# EAGLE design 2x8 GPIO board (EAGLE 6.2)
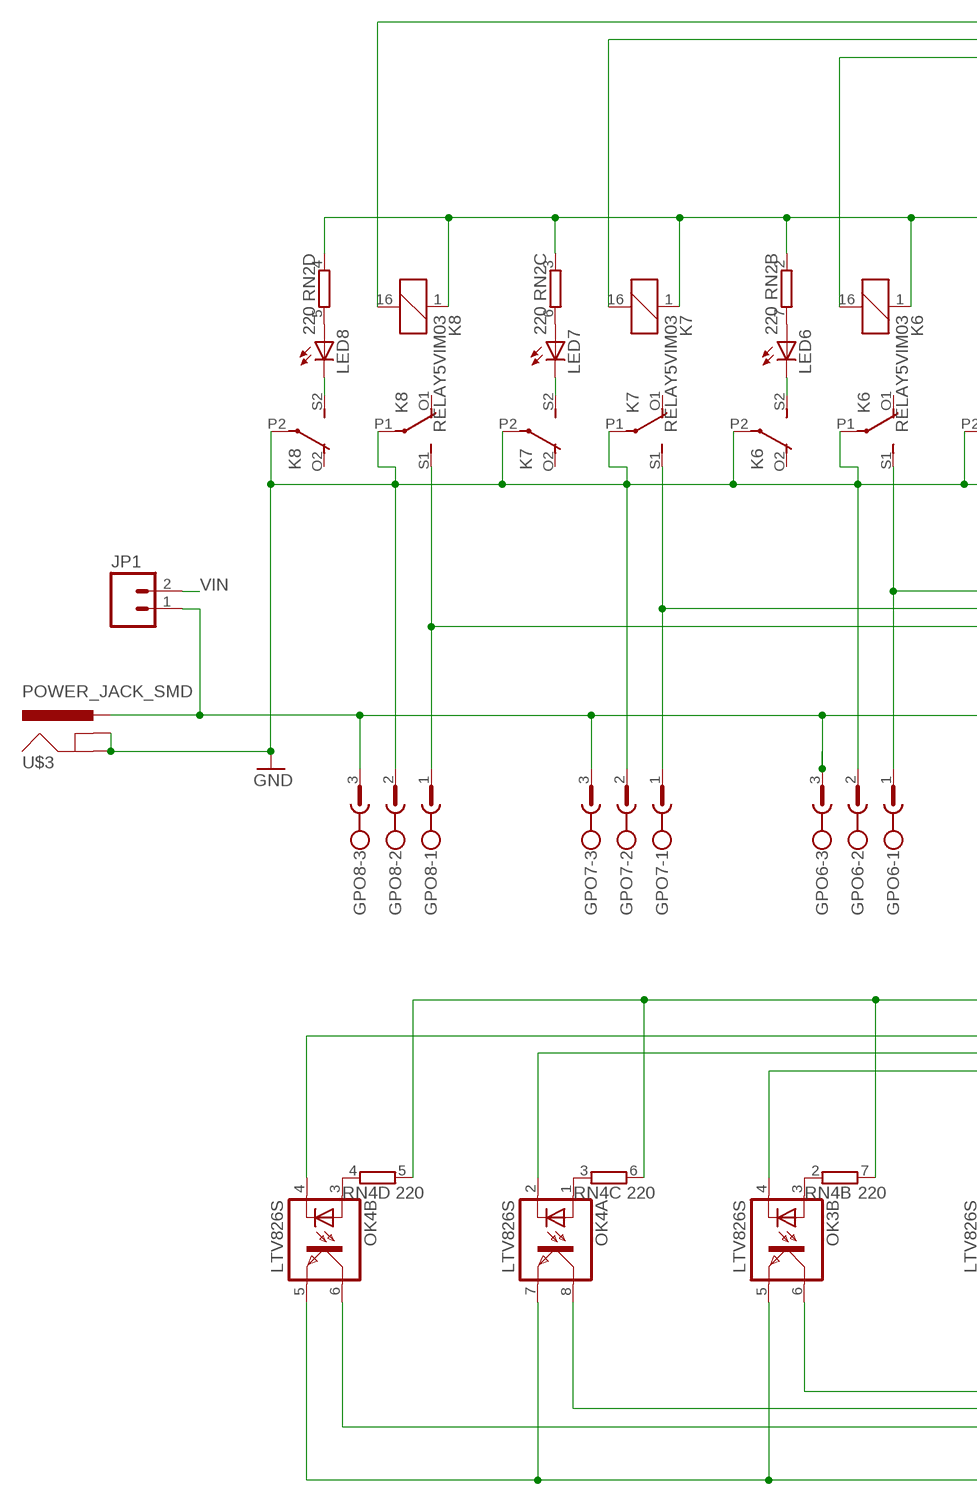
[diagram p0: schematic, sheet 1, part 1 of 2]
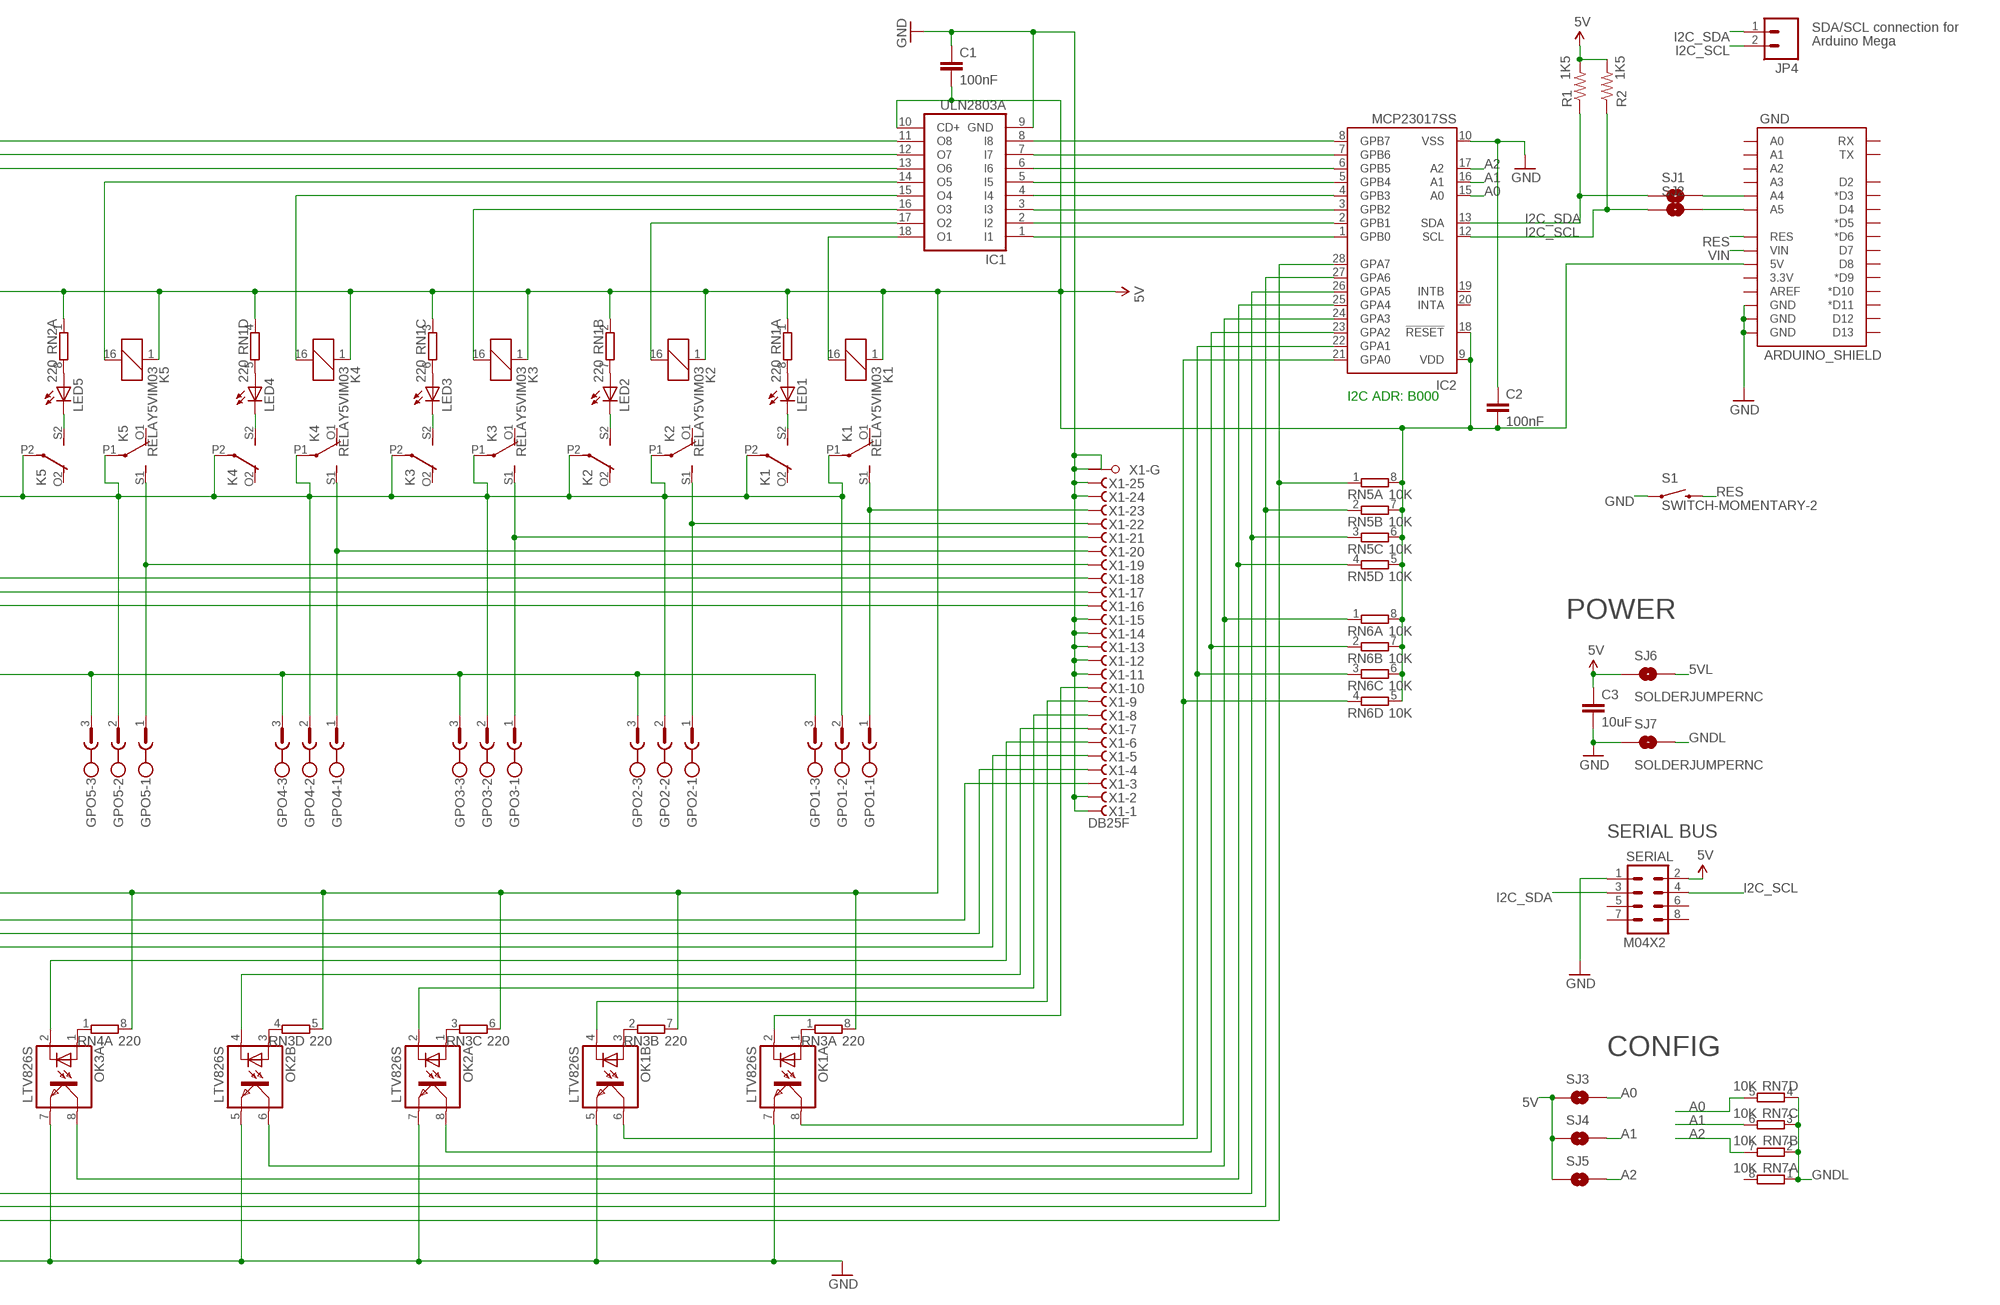
[diagram p1: schematic, sheet 1, part 2 of 2]

## Parts
C1  100nF  CAP0805  [0805]
C2  100nF  CAP0603-CAP  [0603-CAP]
C3  10uF  CAP0805  [0805]
GND  ARDUINO_SHIELD  [ARDUINO_BOXSHIELD_NOHOLES]
GPO1  CON1  MSTBV3  [MSTBV3]
GPO2  CON1  MSTBV3  [MSTBV3]
GPO3  CON1  MSTBV3  [MSTBV3]
GPO4  CON1  MSTBV3  [MSTBV3]
GPO5  CON1  MSTBV3  [MSTBV3]
GPO6  CON1  MSTBV3  [MSTBV3]
GPO7  CON1  MSTBV3  [MSTBV3]
GPO8  GPO8  MSTBV3  [MSTBV3]
IC1  ULN2803A  ULN2803ASO18W  [SO18W]
IC2  MCP23017SS  [SSOP28]
JP1  M02LOCK  [1X02_LOCK]
JP4  M02PTH  [1X02]
K1  RELAY5VIM03  [DS2Y]
K2  RELAY5VIM03  [DS2Y]
K3  RELAY5VIM03  [DS2Y]
K4  RELAY5VIM03  [DS2Y]
K5  RELAY5VIM03  [DS2Y]
K6  RELAY5VIM03  [DS2Y]
K7  RELAY5VIM03  [DS2Y]
K8  RELAY5VIM03  [DS2Y]
LED1  LED0603  [LED-0603]
LED2  LED0603  [LED-0603]
LED3  LED0603  [LED-0603]
LED4  LED0603  [LED-0603]
LED5  LED0603  [LED-0603]
LED6  LED0603  [LED-0603]
LED7  LED0603  [LED-0603]
LED8  LED0603  [LED-0603]
OK1  LTV826S  [DIL8-SMD]
OK2  LTV826S  [DIL8-SMD]
OK3  LTV826S  [DIL8-SMD]
OK4  LTV826S  [DIL8-SMD]
R1  1K5  RESISTOR0603-RES  [0603-RES]
R2  1K5  RESISTOR0603-RES  [0603-RES]
RN1  220  4R-NCAY16  [CAY16]
RN2  220  4R-NCAY16  [CAY16]
RN3  220  4R-NCAY16  [CAY16]
RN4  220  4R-NCAY16  [CAY16]
RN5  10K  4R-NCAY16  [CAY16]
RN6  10K  4R-NCAY16  [CAY16]
RN7  10K  4R-NCAY16  [CAY16_HAND]
S1  SWITCH-MOMENTARY-2  [TACTILE_SWITCH_TALL]
SERIAL  M04X2  [2X4]
SJ1  SOLDERJUMPERNC  [SJ_2S]
SJ2  SOLDERJUMPERNC  [SJ_2S]
SJ3  SOLDERJUMPERNC  [SJ_2S]
SJ4  SOLDERJUMPERNC  [SJ_2S]
SJ5  SOLDERJUMPERNC  [SJ_2S]
SJ6  SOLDERJUMPERNC  [SJ_2S]
SJ7  SOLDERJUMPERNC  [SJ_2S]
U$3  POWER_JACK_SMD  [POWER_JACK_SMD]
X1  DB25F  F25HPS  [F25HP]

## Nets
5V [PWR]: C1.2 C2.2 C3.1 GND.5V@0(5V) IC1.10(CD+) IC2.9(VDD) IC2.18(!RESET) K1.1 K2.1 K3.1 K4.1 K5.1 K6.1 K7.1 K8.1 R1.2 R2.2 RN1.1 RN1.2 RN1.3 RN1.4 RN2.1 RN2.2 RN2.3 RN2.4 RN3.5 RN3.6 RN3.7 RN3.8 RN4.5 RN4.6 RN4.7 RN4.8 RN5.5 RN5.6 RN5.7 RN5.8 RN6.5 RN6.6 RN6.7 RN6.8 SERIAL.2 SJ3.1 SJ4.1 SJ5.1 SJ6.1
5VL: SJ6.2
A0: IC2.15(A0) RN7.5 SJ3.2
A1: IC2.16(A1) RN7.6 SJ4.2
A2: IC2.17(A2) RN7.7 SJ5.2
GND [PWR]: C1.1 C2.1 C3.2 GND.GND@0(GND) GND.GND@1(GND) GND.GND@4(GND) GPO1.2 GPO2.2 GPO3.2 GPO4.2 GPO5.2 GPO6.2 GPO7.2 GPO8.2 IC1.9(GND) IC2.10(VSS) K1.P1(2:P) K1.P2(3:P) K2.P1(2:P) K2.P2(3:P) K3.P1(2:P) K3.P2(3:P) K4.P1(2:P) K4.P2(3:P) K5.P1(2:P) K5.P2(3:P) K6.P1(2:P) K6.P2(3:P) K7.P1(2:P) K7.P2(3:P) K8.P1(2:P) K8.P2(3:P) OK1.5(B:EMIT) OK1.7(A:EMIT) OK2.5(B:EMIT) OK2.7(A:EMIT) OK3.5(B:EMIT) OK3.7(A:EMIT) OK4.5(B:EMIT) OK4.7(A:EMIT) S1.A2 SERIAL.1 SJ7.1 U$3.GND U$3.SHUNT(GNDBREAK) X1.1(-1:F) X1.2(-2:F) X1.11(-11:F) X1.12(-12:F) X1.13(-13:F) X1.14(-14:F) X1.15(-15:F) X1.24(-24:F) X1.25(-25:F) X1.G1(-G:G1) X1.G2(-G:G2)
GNDL: RN7.1 RN7.2 RN7.3 RN7.4 SJ7.2
I2C_SCL: IC2.12(SCL) JP4.2 R2.1 SERIAL.4 SJ2.1
I2C_SDA: IC2.13(SDA) JP4.1 R1.1 SERIAL.3 SJ1.1
N$1 [RELAY LINES]: GPO1.1 K1.S1(2:S) X1.23(-23:F)
N$3: K1.S2(3:S) LED1.C
N$4: IC1.18(O1) K1.16
N$5: IC1.1(I1) IC2.1(GPB0)
N$6 [RELAY LINES]: GPO2.1 K2.S1(2:S) X1.22(-22:F)
N$8: K2.S2(3:S) LED2.C
N$9: IC1.17(O2) K2.16
N$10 [RELAY LINES]: GPO3.1 K3.S1(2:S) X1.21(-21:F)
N$12: K3.S2(3:S) LED3.C
N$13: IC1.16(O3) K3.16
N$14 [RELAY LINES]: GPO4.1 K4.S1(2:S) X1.20(-20:F)
N$16: K4.S2(3:S) LED4.C
N$17: IC1.15(O4) K4.16
N$18 [RELAY LINES]: GPO5.1 K5.S1(2:S) X1.19(-19:F)
N$19: GND.A4 SJ1.2
N$20: K5.S2(3:S) LED5.C
N$21: IC1.14(O5) K5.16
N$22 [RELAY LINES]: GPO6.1 K6.S1(2:S) X1.18(-18:F)
N$23: GND.A5 SJ2.2
N$24: K6.S2(3:S) LED6.C
N$25: IC1.13(O6) K6.16
N$26 [RELAY LINES]: GPO7.1 K7.S1(2:S) X1.17(-17:F)
N$28: K7.S2(3:S) LED7.C
N$29: IC1.12(O7) K7.16
N$30 [RELAY LINES]: GPO8.1 K8.S1(2:S) X1.16(-16:F)
N$31: GPO1.3 GPO2.3 GPO3.3 GPO4.3 GPO5.3 GPO6.3 GPO7.3 GPO8.3 JP1.1 U$3.PWR
N$32: K8.S2(3:S) LED8.C
N$33: IC1.11(O8) K8.16
N$34: IC1.2(I2) IC2.2(GPB1)
N$35: IC1.3(I3) IC2.3(GPB2)
N$36: IC1.4(I4) IC2.4(GPB3)
N$37: IC1.5(I5) IC2.5(GPB4)
N$38: IC1.6(I6) IC2.6(GPB5)
N$39: IC1.7(I7) IC2.7(GPB6)
N$40: IC1.8(I8) IC2.8(GPB7)
N$41: LED1.A RN1.8
N$42: LED2.A RN1.7
N$43: LED3.A RN1.6
N$44: LED4.A RN1.5
N$45: LED5.A RN2.8
N$46: LED6.A RN2.7
N$47: LED7.A RN2.6
N$48: LED8.A RN2.5
N$49 [INput lines]: OK1.2(A:C) X1.10(-10:F)
N$50: OK1.1(A:A) RN3.1
N$51: IC2.21(GPA0) OK1.8(A:COL) RN6.4
N$52: OK1.3(B:A) RN3.2
N$53: OK2.1(A:A) RN3.3
N$54: OK2.3(B:A) RN3.4
N$55 [INput lines]: OK3.2(A:C) X1.6(-6:F)
N$56: OK3.1(A:A) RN4.1
N$57: OK3.3(B:A) RN4.2
N$58: OK4.1(A:A) RN4.3
N$59: OK4.3(B:A) RN4.4
N$60 [INput lines]: OK1.4(B:C) X1.9(-9:F)
N$61 [INput lines]: OK2.2(A:C) X1.8(-8:F)
N$62 [INput lines]: OK2.4(B:C) X1.7(-7:F)
N$63: IC2.28(GPA7) OK4.6(B:COL) RN5.1
N$64 [INput lines]: OK3.4(B:C) X1.5(-5:F)
N$65 [INput lines]: OK4.2(A:C) X1.4(-4:F)
N$66 [INput lines]: OK4.4(B:C) X1.3(-3:F)
N$68: IC2.22(GPA1) OK1.6(B:COL) RN6.3
N$69: IC2.23(GPA2) OK2.8(A:COL) RN6.2
N$70: IC2.24(GPA3) OK2.6(B:COL) RN6.1
N$71: IC2.25(GPA4) OK3.8(A:COL) RN5.4
N$72: IC2.26(GPA5) OK3.6(B:COL) RN5.3
N$73: IC2.27(GPA6) OK4.8(A:COL) RN5.2
RES: GND.RESET(RES) S1.B2
VIN: GND.VIN JP1.2
Unconnected: GND.0(RX) GND.1(TX) GND.2(D2) GND.3(*D3) GND.3.3V GND.4(D4) GND.5(*D5) GND.6(*D6) GND.7(D7) GND.8(D8) GND.9(*D9) GND.10(*D10) GND.11(*D11) GND.12(D12) GND.13(D13) GND.A0 GND.A1 GND.A2 GND.A3 GND.AREF IC2.19(INTB) IC2.20(INTA) K1.O1(2:O) K1.O2(3:O) K2.O1(2:O) K2.O2(3:O) K3.O1(2:O) K3.O2(3:O) K4.O1(2:O) K4.O2(3:O) K5.O1(2:O) K5.O2(3:O) K6.O1(2:O) K6.O2(3:O) K7.O1(2:O) K7.O2(3:O) K8.O1(2:O) K8.O2(3:O) RN7.8 SERIAL.5 SERIAL.6 SERIAL.7 SERIAL.8

## Notes on the sheet
- SDA/SCL connection for
- Arduino Mega
- I2C ADR: B000
- POWER
- SERIAL BUS
- CONFIG

## Library data of the parts
C1-C3 = SparkFun:CAP: Capacitor Standard 0603 ceramic capacitor, and 0.1" leaded capacitor.
GND = SKAARHOJ:ARDUINO_SHIELD
GPO1-GPO8 = con-phoenix-508:MSTBV3: PHOENIX; MPN: MSTBV 2,5/3-GF-5.08; OC_FARNELL: 1792793; OC_NEWARK: 69R9846
IC1 = uln-udn:ULN2803A: DRIVER ARRAY
IC2 = microchip:MCP23017: http://ww1.microchip.com/downloads/en/DeviceDoc/21952a.pdf Source: http://ww1.microchip.com/downloads/en/DeviceDoc/21952a.pdf; MF: MICROCHIP; MPN: MCP23017-E/SS; OC_FARNELL: 1467674; OC_NEWARK: 31K2960
JP1 JP4 = SparkFun:M02: Header 2 Standard 2-pin 0.1" header. Use with straight break away headers (SKU : PRT-00116), right angle break away headers (PRT-00553), swiss pins (PRT-00743), machine pins (PRT-00117), and female headers (PRT-00115). Molex polarized connector foot print use with SKU : PRT-08233 with associated crimp pins and housings.
K1-K8 = SKAARHOJ:RELAY5V: RELAY 2 x switch, AxiCom 150 mW 5V
LED1-LED8 = SparkFun:LED: LEDs Standard schematic elements and footprints for 5mm, 3mm, 1206, and 0603 sized LEDs. 5mm - Spark Fun Electronics SKU : COM-00529 (and others)
OK1-OK4 = optocoupler:LTV826: OPTO COUPLER Source: LITEON, LTV816.pdf; OC_FARNELL: unknown; OC_NEWARK: unknown
R1 R2 = SparkFun:RESISTOR: Resistor Basic schematic elements and footprints for 0603, 1206, and PTH resistors.
RN1-RN6 = resistor-dil:4R-N: Array Chip Resistor Source: RS Component / Phycomp; OC_FARNELL: unknown; OC_NEWARK: unknown
RN7 = SKAARHOJ:4R-N: Array Chip Resistor Source: RS Component / Phycomp; OC_FARNELL: unknown; OC_NEWARK: unknown
S1 = SparkFun:SWITCH-MOMENTARY-2
SERIAL = SparkFun:M04X2
SJ1-SJ7 = SparkFun:SOLDERJUMPER: Solder Jumper Standard SMD solder jumper. Used to automate production. Two varients : Normally Open and Normally Closed are the same, but have different paste layers. NC will have a large amount of paste and should jumper during reflow.
U$3 = SKAARHOJ:POWER_JACK_SMD: RASM712PX Right Angle SMT Mount DC Power Jack, pin size 0.100"(2.5mm), with locating post Switchcraft.com
X1 = con-subd:F25HPS: SUB-D; OC_FARNELL: unknown; OC_NEWARK: unknown

## Net classes
0 default: width 0.203 mm, drill 0.406 mm, clearance 0.203 mm
1 PWR: width 0.406 mm, drill 0.61 mm, clearance 0.203 mm
2 RELAY LINES: width 0.305 mm, clearance 0.203 mm
3 INput lines: clearance 0.203 mm

## Board
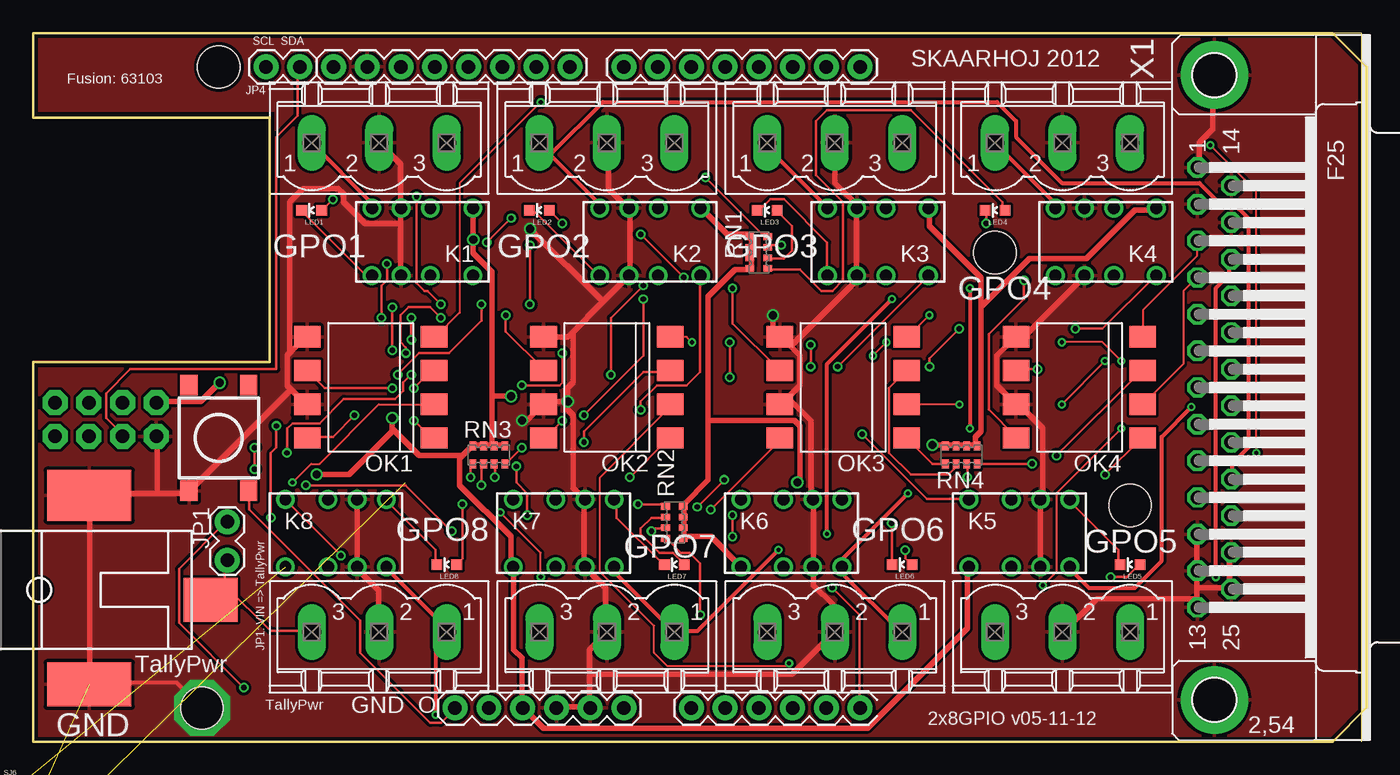
[diagram p2: board, top side]
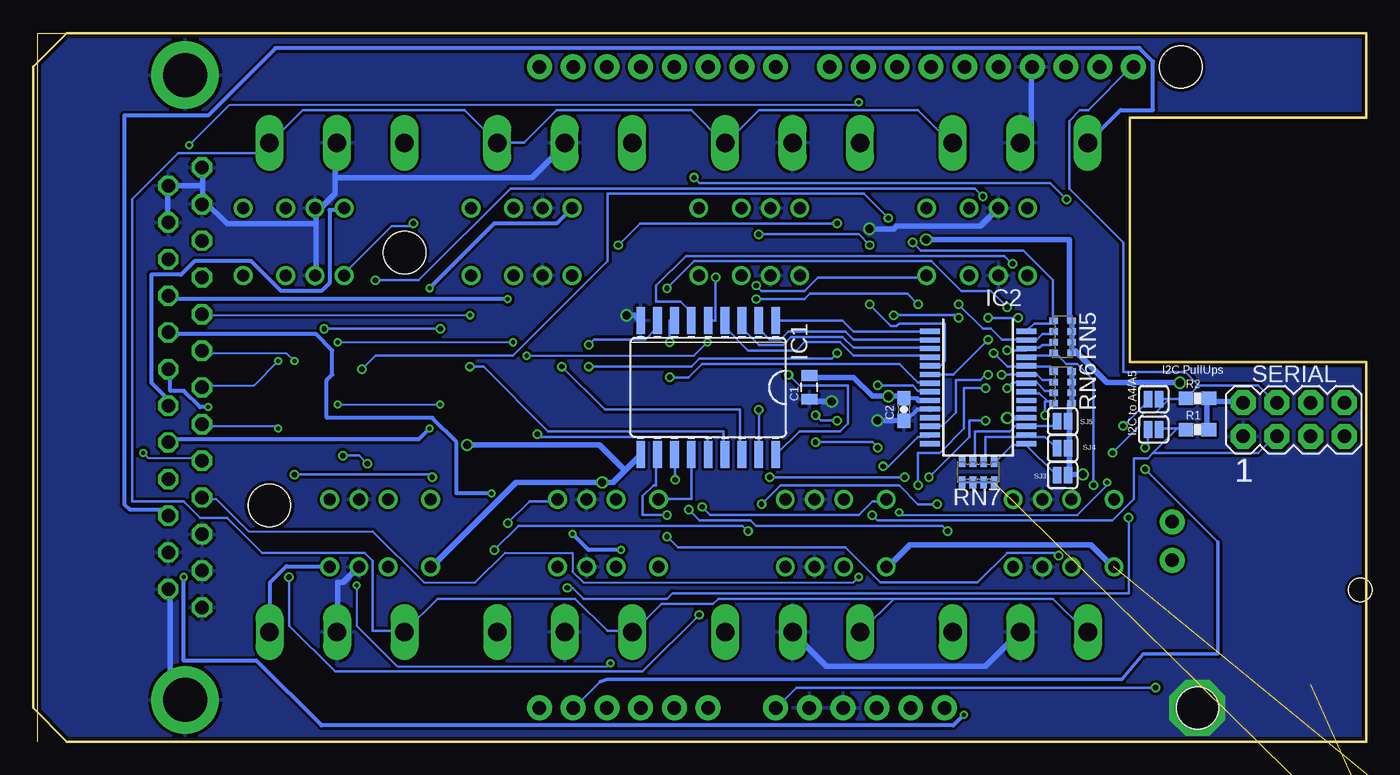
[diagram p3: board, bottom side, seen from below]

Size 100.33 x 53.34 mm. Coordinates in mm from the lower left corner, seen from the top.
Outline: 100,0 100,53.33 0,53.33
Copper layers (1*16): Top 0.035mm / dielectric 1.5mm / Bottom 0.035mm
Design rules: minimum track width 6mil, minimum drill 12mil, track to track 6mil, track to pad 6mil, pad to pad 6mil, via to via 6mil, smd to smd 0mil, copper to edge 10mil, drill to drill 10mil, minimum pad ring 10mil, minimum via ring 6mil, stop-mask expansion 2mil, vias tented up to drill 100mil, thermal gap 10mil
Holes 3.2 mm at 72.39,36.83 82.55,17.78

### Footprints (pad centres in the part's own frame; a part is rotated, then mirrored left to right if it is on the bottom)
0805 = smd 0.8 x 1.2: 1 -0.9,0; 2 0.9,0
0603-CAP = smd 1.1 x 1: 1 -0.85,0; 2 0.85,0
ARDUINO_BOXSHIELD_NOHOLES = drill 1.016 pad 1.88: 0 62.23,50.8; 1 59.69,50.8; 2 57.15,50.8; 3 54.61,50.8; 3.3V 34.29,2.54; 4 52.07,50.8; 5 49.53,50.8; 5V@0 36.83,2.54; 6 46.99,50.8; 7 44.45,50.8; 8 40.386,50.8; 9 37.846,50.8; 10 35.306,50.8; 11 32.766,50.8; 12 30.226,50.8; 13 27.686,50.8; A0 49.53,2.54; A1 52.07,2.54; A2 54.61,2.54; A3 57.15,2.54; A4 59.69,2.54; A5 62.23,2.54; AREF 22.606,50.8; GND@0 39.37,2.54; GND@1 41.91,2.54; GND@4 25.146,50.8; RESET 31.75,2.54; VIN 44.45,2.54 | hole 3.2: 13.97,50.8; 12.7,2.54
MSTBV3 = drill 1.397 long: 1 -5.08,0; 2 0,0; 3 5.08,0
SO18W = smd 0.66 x 2.032: 1 -5.08,-5.029; 2 -3.81,-5.029; 3 -2.54,-5.029; 4 -1.27,-5.029; 5 0,-5.029; 6 1.27,-5.029; 7 2.54,-5.029; 8 3.81,-5.029; 9 5.08,-5.029; 10 5.08,5.029; 11 3.81,5.029; 12 2.54,5.029; 13 1.27,5.029; 14 0,5.029; 15 -1.27,5.029; 16 -2.54,5.029; 17 -3.81,5.029; 18 -5.08,5.029
SSOP28 = smd 0.4 x 1.5: 1 -4.225,-3.625; 2 -3.575,-3.625; 3 -2.925,-3.625; 4 -2.275,-3.625; 5 -1.625,-3.625; 6 -0.975,-3.625; 7 -0.325,-3.625; 8 0.325,-3.625; 9 0.975,-3.625; 10 1.625,-3.625; 11 2.275,-3.625; 12 2.925,-3.625; 13 3.575,-3.625; 14 4.225,-3.625; 15 4.225,3.625; 16 3.575,3.625; 17 2.925,3.625; 18 2.275,3.625; 19 1.625,3.625; 20 0.975,3.625; 21 0.325,3.625; 22 -0.325,3.625; 23 -0.975,3.625; 24 -1.625,3.625; 25 -2.275,3.625; 26 -2.925,3.625; 27 -3.575,3.625; 28 -4.225,3.625
1X02_LOCK = drill 1.016 pad 1.88: 1 -0.178,0; 2 2.718,0
1X02 = drill 1.016 pad 1.88: 1 0,0; 2 2.54,0
DS2Y = drill 0.9: 1 1.2,0.46; 16 1.2,5.54; O1 4.4,0.46; O2 4.4,5.54; P1 6.6,0.46; P2 6.6,5.54; S1 8.8,0.46; S2 8.8,5.54
LED-0603 = smd 0.8 x 0.8: A 0,-0.75; C 0,0.75
DIL8-SMD = smd 1.6 x 2: 1 -3.81,-4.77; 2 -1.27,-4.77; 3 1.27,-4.77; 4 3.81,-4.77; 5 3.81,4.77; 6 1.27,4.77; 7 -1.27,4.77; 8 -3.81,4.77
0603-RES = smd 1.1 x 1: 1 -0.85,0; 2 0.85,0
CAY16 = smd 0.5 x 0.65: 1 -1.2,-0.675; 2 -0.4,-0.675; 3 0.4,-0.675; 4 1.2,-0.675; 5 1.2,0.675; 6 0.4,0.675; 7 -0.4,0.675; 8 -1.2,0.675
CAY16_HAND = smd 0.5 x 0.904: 1 -1.2,-0.813; 2 -0.4,-0.813; 3 0.4,-0.813; 4 1.2,-0.813; 5 1.2,0.813; 6 0.4,0.813; 7 -0.4,0.813; 8 -1.2,0.813
TACTILE_SWITCH_TALL = smd 1.55 x 1.3: A1 -3.975,-2.25; A2 3.975,-2.25; B1 -3.975,2.25; B2 3.975,2.25
2X4 = drill 1.016 pad 1.88 octagon: 1 -3.81,-1.27; 2 -3.81,1.27; 3 -1.27,-1.27; 4 -1.27,1.27; 5 1.27,-1.27; 6 1.27,1.27; 7 3.81,-1.27; 8 3.81,1.27
SJ_2S = smd 0.635 x 1.27: 1 -0.412,0; 2 0.412,0
POWER_JACK_SMD = smd 6.35 x 3.81: GND -6.756,-7.112 | smd 4.064 x 3.302: PWR -15.9,0.762 | smd 6.35 x 3.302: SHUNT -6.756,7.112 | hole 1.778: -2.997,0
F25HP = drill 1.016 octagon: 1 -16.561,-1.27; 2 -13.792,-1.27; 3 -11.049,-1.27; 4 -8.28,-1.27; 5 -5.512,-1.27; 6 -2.769,-1.27; 7 0,-1.27; 8 2.769,-1.27; 9 5.512,-1.27; 10 8.28,-1.27; 11 11.049,-1.27; 12 13.792,-1.27; 13 16.561,-1.27; 14 -15.189,1.27; 15 -12.421,1.27; 16 -9.652,1.27; 17 -6.909,1.27; 18 -4.14,1.27; 19 -1.372,1.27; 20 1.372,1.27; 21 4.14,1.27; 22 6.909,1.27; 23 9.652,1.27; 24 12.421,1.27; 25 15.189,1.27 | drill 3.302 pad 5.08: G1 -23.52,0; G2 23.52,0

### Placement (x,y rotation side)
C1  41.91,26.67 90 bottom
C2  34.8,25.02 90 bottom
C3  -1.27,-12.7 0 top  (outside the outline)
GND  0,0 0 top
GPO1  26.04,45.09 0 top
GPO2  43.18,45.09 0 top
GPO3  60.33,45.09 0 top
GPO4  77.47,45.09 0 top
GPO5  77.47,8.26 180 top
GPO6  60.33,8.26 180 top
GPO7  43.18,8.26 180 top
GPO8  26.04,8.26 180 top
IC1  49.53,26.67 180 bottom
IC2  29.21,26.67 270 bottom
JP1  14.61,13.84 90 top
JP4  20.07,50.8 180 top
K1  34.29,40.64 180 top
K2  51.44,40.64 180 top
K3  68.58,40.64 180 top
K4  85.72,40.64 180 top
K5  69.22,12.7 0 top
K6  52.07,12.7 0 top
K7  34.92,12.7 0 top
K8  17.78,12.7 0 top
LED1  20.95,40.01 90 top
LED2  38.1,40.01 90 top
LED3  55.24,40.01 90 top
LED4  72.39,40.01 90 top
LED5  82.55,13.34 90 top
LED6  65.41,13.34 90 top
LED7  48.26,13.34 90 top
LED8  31.11,13.34 90 top
OK1  25.4,26.67 90 top
OK2  43.18,26.67 90 top
OK3  60.96,26.67 90 top
OK4  78.74,26.67 90 top
R1  12.7,23.5 0 bottom
R2  12.7,25.86 0 bottom
RN1  54.61,36.83 270 top
RN2  48.26,16.51 90 top
RN3  34.29,21.59 0 top
RN4  69.85,21.59 0 top
RN5  22.86,30.48 270 bottom
RN6  22.86,26.67 270 bottom
RN7  29.21,20.32 0 bottom
S1  13.97,22.86 270 top
SERIAL  5.46,24.26 0 bottom
SJ1  16,23.5 180 bottom
SJ2  16,25.78 180 bottom
SJ3  22.86,20.07 180 bottom
SJ4  22.86,22.1 180 bottom
SJ5  22.86,24.13 180 bottom
SJ6  -1.27,-3.81 0 top  (outside the outline)
SJ7  -1.27,-8.89 0 top  (outside the outline)
U$3  -2.54,11.43 180 top
X1  88.9,26.67 270 top

### Tracks (layer width: path | path; a pad name or v marks a point on that pad's centre or on a via)
5V  (via drill 0.61)  (2 unrouted)
  Top 0.406: K2.1 50.39,40.03 52.22,38.2 53.85,38.2 RN1.1 54.05,38 54.05,37.39 RN1.2 54.05,37.19 54.05,36.58 RN1.3 54.05,36.37 54.05,35.76 RN1.4 53.85,35.56 52.83,35.56 50.8,33.53 50.8,24.18 | K6.1 53.24,13.21 51,15.44 49.17,15.44 RN2.1 48.97,15.44 48.97,16.05 RN2.2 48.97,16.26 48.97,16.87 RN2.3 48.97,17.07 48.97,17.68 RN2.4 48.97,17.88 50.8,19.71 50.8,24.18 | 71.32,32.72 71.32,34.95 67.46,38.81 67.46,40.03 K3.1 | 71.32,32.72 71.32,23.37 70.92,22.96 70.92,22.55 RN4.5 70.92,22.35 70.31,22.35 RN4.6 70.1,22.35 69.49,22.35 RN4.7 69.29,22.35 68.68,22.35 RN4.8 68.48,22.35 v67.67,22.35 | 71.32,32.72 74.98,36.37 79.25,36.37 82.91,40.03 84.33,40.03 K4.1 | 50.8,24.18 57.3,24.18 57.71,23.77 57.71,19.71 v57.51,19.51 | v14.02,27.03 12.6,25.6 9.35,25.6 SERIAL.2 | RN3.6 34.75,22.35 35.36,22.35 RN3.5 | RN3.6 34.54,22.35 33.93,22.35 RN3.7 33.73,22.35 33.12,22.35 RN3.8 32.92,22.15 32.21,21.44 | 32.21,21.44 32.11,21.34 32.11,19.3 35.97,15.44 35.97,13.21 K7.1 36.17,13.01 36.17,6.91 36.78,6.3 36.78,2.64 GND.5V@0 36.98,2.44 38.41,1.02 62.79,1.02 70.31,8.53 70.31,13.01 K5.1 | v27.03,24.38 27.03,23.57 27.13,23.47 | 27.13,23.47 29.06,21.54 32.11,21.54 32.21,21.44 | 34.54,26.01 34.54,22.55 RN3.6 | 34.54,26.01 34.54,35.36 33.12,36.78 v33.12,37.8 33.12,40.03 K1.1 | 34.54,26.01 v35.97,26.01 | v21.34,20.12 23.77,20.12 27.13,23.47
  Bottom 0.305: C2.2 33.78,25.87 33.78,25.65 32.84,25.65 IC2.9
  Bottom 0.406: 55.78,20.42 56.69,19.51 v57.51,19.51 64.01,19.51 70.31,13.21 K5.1 | 55.78,20.42 54.66,21.54 IC1.10 | 55.78,20.42 57.71,22.35 v67.67,22.35 | R1.2 11.99,23.57 11.99,25.81 R2.2 11.79,25.81 11.58,25.6 9.35,25.6 SERIAL.2 | v14.02,27.03 19.51,27.03 21.95,29.46 RN5.5 22.15,29.46 22.15,30.07 RN5.6 22.15,30.28 22.15,30.68 RN5.7 22.15,31.09 22.15,31.5 RN5.8 22.35,31.7 22.35,37.8 v33.12,37.8 | RN6.8 22.15,27.84 22.15,27.23 RN6.7 22.15,27.03 22.15,26.42 RN6.6 22.15,26.21 22.15,25.6 RN6.5 22.35,25.4 22.35,24.18 SJ5.1 22.35,23.98 22.35,22.15 SJ4.1 22.35,21.95 22.35,20.12 SJ3.1 22.15,20.12 v21.34,20.12 | C1.2 41.86,27.43 38.61,27.43 37.19,26.01 v35.97,26.01 34.95,26.01 C2.2 | v27.03,24.38 25.6,24.38 IC2.18 | K8.1 19.1,13.21 20.73,14.83 34.34,14.83 35.97,13.21 K7.1
A0
  Bottom 0.203: 25.6,22.35 26.62,22.35 27.84,21.13 RN7.5 | 25.6,22.35 23.37,20.12 SJ3.2 | 25.6,22.35 IC2.15
A1
  Bottom 0.203: RN7.6 28.65,21.13 28.65,22.96 25.6,22.96 IC2.16 25.4,22.96 24.18,22.96 23.37,22.15 SJ4.2
A2
  Bottom 0.203: RN7.7 29.46,21.13 29.46,23.37 26.82,23.37 26.42,23.77 25.6,23.77 IC2.17 25.4,23.77 23.57,23.77 23.37,23.98 SJ5.2
GND  (via drill 0.61, 3.2)  (2 unrouted)
  Top 0.305: 4.27,4.47 10.77,4.47 v12.7,2.54
  Top 0.406: 27.64,39.01 27.64,40.03 K1.P1 27.64,40.23 27.64,43.48 GPO1.2 | 27.64,39.01 27.64,35.15 K1.P2 | 19.41,26.52 19.1,26.82 19.1,29.06 19.41,29.36 | 19.41,26.52 20.52,25.4 OK1.7 | 19.41,29.36 20.52,30.48 OK1.5 | 9.35,18.69 4.27,18.69 U$3.GND 4.27,18.49 4.27,4.47 U$3.SHUNT | 9.35,18.69 11.58,18.69 S1.A2 11.79,18.9 19.41,26.52 | 9.35,18.69 9.35,22.96 SERIAL.1 | 27.64,39.01 24.99,39.01 23.37,40.64 23.37,41.25 22.96,41.66 20.32,41.66 19.3,40.64 19.3,29.46 19.41,29.36 | v40.23,25.6 38.81,25.6 38.61,25.4 OK2.7 37.19,24.18 v36.78,24.18 | OK2.5 40.23,30.48 40.54,30.79 | 42.88,33.12 44.7,34.95 K2.P2 44.91,35.15 44.91,40.03 K2.P1 44.7,40.23 43.28,41.66 43.28,44.91 GPO2.2 | 42.88,33.12 40.54,30.79 | v40.23,25.6 40.23,26.62 40.64,27.03 40.64,30.68 40.54,30.79 | K8.P2 24.38,18.09 24.38,13.21 K8.P1 24.38,13.01 26.01,11.38 26.01,8.33 GPO8.2 | GND.GND@0 39.42,2.64 41.86,2.64 GND.GND@1 41.86,2.85 41.86,5.08 | 41.86,5.08 41.86,6.91 43.08,8.13 GPO7.2 43.08,8.33 43.08,11.58 41.66,13.01 K7.P1 41.45,13.21 41.45,18.09 K7.P2 41.45,18.29 40.64,19.1 40.64,24.59 40.23,24.99 v40.23,25.6 | OK3.5 56.29,30.48 57.71,29.06 57.71,26.82 56.29,25.4 OK3.7 56.9,25.81 58.52,24.18 58.52,18.29 K6.P2 58.73,18.09 58.73,13.21 K6.P1 58.73,13.01 58.73,11.79 60.15,10.36 60.15,8.33 GPO6.2 60.15,8.13 57.1,5.08 41.86,5.08 | v55.68,32.11 55.68,30.89 56.08,30.48 OK3.5 | GPO3.2 60.35,44.91 60.35,42.06 62.18,40.23 K3.P1 61.98,40.03 61.98,35.15 K3.P2 62.18,34.95 57.1,29.87 OK3.5 | 87.58,11.58 87.58,12.8 X1.12 87.58,13.01 87.58,15.44 X1.11 | 87.58,11.58 87.58,10.77 | 87.58,10.77 87.58,10.16 X1.13 87.58,10.77
  Top 0.406: 87.58,11.58 90.02,11.58 X1.25 90.02,11.79 90.02,14.22 X1.24 | K5.P1 75.79,13.21 75.79,18.09 K5.P2 76,18.29 76,23.57 74.17,25.4 OK4.7 72.54,26.82 72.54,29.06 OK4.5 74.57,30.48 79.05,34.95 K4.P2 | X1.G1 88.8,50.19 88.8,46.13 87.78,45.11 87.78,43.28 X1.1 | 87.58,10.77 80.06,10.77 77.62,8.33 GPO5.2 | 42.88,33.12 v37.39,38.61
  Bottom 0.305: C2.1 34.63,24.17 33.78,25.02 32.86,25.02 IC2.10
  Bottom 0.406: GND.GND@4 25.2,50.8 25.2,45.11 26.01,45.11 GPO1.2 | v40.23,25.6 41.86,25.6 C1.1 | v36.78,24.18 34.95,24.18 C2.1 | GPO8.2 26.21,8.13 28.65,5.69 40.64,5.69 43.08,8.13 GPO7.2 | v55.68,32.11 55.07,32.11 54.66,31.7 IC1.9 | X1.25 90.02,11.38 90.02,3.25 89,3.25 X1.G2 | GPO5.2 77.42,8.33 77.42,11.99 77.01,11.99 76,13.01 K5.P1 | X1.15 90.22,39.22 90.22,41.86 X1.14 87.58,41.86 | 87.58,41.86 87.58,43.08 X1.1 | 87.58,41.86 87.58,40.64 X1.2 87.38,40.64 85.75,39.01 79.05,39.01 | 79.05,39.01 79.05,35.15 K4.P2 | 79.05,39.01 79.05,40.03 K4.P1 78.84,40.03 77.62,41.25 77.62,42.47 | 77.62,42.47 77.62,44.91 GPO4.2 | 77.62,42.47 62.79,42.47 60.35,44.91 GPO3.2 | v37.39,38.61 35.56,38.61 35.36,38.81 29.06,38.81 27.84,40.03 K1.P1
  pour Top: 0,0 100.33,0 100.33,53.34 0,53.34
  pour Bottom: 0,0 100.33,0 100.33,53.34 0,53.34
GNDL  (1 unrouted)
  Bottom 0.203: RN7.4 RN7.3 RN7.2 RN7.1
I2C_SCL  (via drill 0.41)
  Top 0.203: v28.45,27.64 27.84,27.03 27.84,26.42 27.23,25.81 23.37,25.81 21.54,23.98 19.51,23.98 19.1,23.57 v19.1,21.74
  Bottom 0.203: 14.83,25.81 15.44,25.81 SJ2.1 | 14.83,25.81 13.61,25.81 R2.1 13.41,26.01 12.6,26.82 | v28.45,27.64 28.65,27.64 29.06,27.23 30.89,27.23 30.89,24.79 31.9,23.77 32.72,23.77 IC2.12 | v19.1,21.74 17.07,23.77 17.07,24.38 16.66,24.79 15.85,24.79 14.83,25.81 | 12.6,26.82 8.13,26.82 6.91,25.6 SERIAL.4 | 12.6,26.82 13.61,27.84 18.29,27.84 18.29,37.59 22.35,41.66 22.35,46.74 21.54,47.55 20.93,47.55 17.68,50.8 JP4.2
I2C_SDA  (via drill 0.41)
  Top 0.203: v36.37,20.73 36.37,19.51 37.19,18.69 v37.19,17.07 | JP4.1 19.91,50.8 19.91,47.14 18.29,45.52 18.29,28.04 7.32,28.04 5.49,26.21 5.49,24.38 6.71,23.16 SERIAL.3
  Bottom 0.203: 14.22,23.57 15.44,23.57 SJ1.1 | 14.22,23.57 13.61,23.57 R1.1 | v36.37,20.73 35.97,20.73 33.73,22.96 32.92,22.96 IC2.13 | v37.19,17.07 36.78,16.66 19.1,16.66 17.48,18.29 17.48,21.34 16.46,21.34 16.05,21.74 | 14.22,23.57 16.05,21.74 | 16.05,21.74 8.13,21.74 6.91,22.96 SERIAL.3
N$1
  Top 0.305: GPO1.1 25.4,40.64 25.4,40.23 K1.S1
  Bottom 0.305: X1.23 90.63,17.48 93.07,17.48 93.47,17.88 93.47,47.14 87.17,47.14 82.09,52.22 17.07,52.22 16.05,51.21 16.05,47.55 18.49,47.55 GPO1.1
N$3
  Top 0.203: LED1.C 20.32,39.83 24.99,35.15 25.4,35.15 K1.S2
N$4  (via drill 0.41)
  Top 0.203: v43.48,27.64 43.48,31.9 v45.92,34.34
  Bottom 0.203: v43.48,27.64 42.67,26.82 39.01,26.82 39.01,23.98 39.62,23.37 42.67,23.37 44.3,21.74 IC1.18 | v45.92,34.34 45.52,33.93 42.27,33.93 41.25,34.95 33.12,34.95 K1.16
N$5
  Bottom 0.203: IC1.1 39.42,31.7 38.61,30.89 32.92,30.89 IC2.1
N$6
  Top 0.305: K2.S1 42.47,40.23 42.47,40.64 38.2,44.91 GPO2.1 39.01,44.3 42.88,48.16 72.54,48.16 73.97,46.74 73.97,45.52 77.42,42.06 87.78,42.06 89.2,40.64 90.22,40.64 91.44,39.42 91.44,22.15 90.22,20.93 90.22,19.91 X1.22
N$8
  Top 0.203: LED2.C 37.39,39.83 37.8,39.83 42.47,35.15 K2.S2
N$9  (via drill 0.41)
  Top 0.203: v45.72,24.99 45.72,25.6 46.94,26.82 49.17,26.82 50.19,27.84 50.19,34.95 K2.16
  Bottom 0.203: v45.72,24.99 IC1.17
N$10  (via drill 0.3)
  Top 0.305: K3.S1 59.74,40.23 55.07,44.91 GPO3.1 | v70.51,34.14 v70.51,23.57
  Bottom 0.305: v70.51,23.57 71.32,22.76 89.81,22.76 90.02,22.55 X1.21 | v70.51,34.14 65.63,39.01 60.96,39.01 59.94,40.03 K3.S1
N$12
  Top 0.203: LED3.C 54.66,40.03 55.47,40.84 56.49,40.84 59.74,37.59 59.74,35.15 K3.S2
N$13  (via drill 0.41)
  Top 0.203: v60.55,28.25 67.26,34.95 K3.16
  Bottom 0.203: v60.55,28.25 57.3,24.99 47.14,24.99 47.14,21.74 IC1.16
N$14
  Top 0.305: K4.S1 76.81,40.23 76.81,40.64 72.54,44.91 GPO4.1
  Bottom 0.305: X1.20 90.22,25.4 90.22,25.81 91.44,27.03 91.44,35.15 89.2,35.15 88.19,36.17 83.92,36.17 81.69,33.93 78.64,33.93 78.03,34.54 78.03,40.03 77.01,40.03 K4.S1
N$16  (via drill 0.41)
  Top 0.203: v71.73,39.01 71.73,39.83 LED4.C
  Bottom 0.203: v71.73,39.01 71.93,38.81 73.36,38.81 77.01,35.15 K4.S2
N$17  (via drill 0.41)
  Top 0.203: v67.46,28.25 67.46,28.85 v69.7,31.09 | v78.44,31.09 80.47,31.09 84.33,34.95 K4.16
  Bottom 0.203: v67.46,28.25 66.45,28.25 61.57,23.37 48.36,23.37 48.36,21.74 IC1.15 | v78.44,31.09 v69.7,31.09
N$18  (via drill 0.3)
  Top 0.305: v87.17,25.2 84.94,22.96 84.94,13.61 82.91,11.58 79.45,11.58 78.03,13.01 K5.S1
  Bottom 0.305: K5.S1 78.03,13.21 81.28,13.21 82.5,11.99 82.5,8.33 GPO5.1 | v87.17,25.2 87.78,25.2 89,26.42 90.02,26.42 90.02,28.04 X1.19
N$19  (via drill 0.41)
  Top 0.203: v16.66,20.52 v16.66,22.15
  Bottom 0.203: v16.66,22.15 16.46,22.15 16.46,23.37 SJ1.2 | 11.18,15.04 v16.66,20.52 | 57.68,4.5 59.54,2.64 GND.A4
  Bottom 0.254: 11.18,15.04 11.18,6.6 16.76,6.6 18.41,4.7 57.12,4.7 57.68,4.5
N$20
  Top 0.203: LED5.C 81.69,13.41 81.69,14.43 78.03,18.09 K5.S2
N$21  (via drill 0.41)
  Top 0.203: v62.38,23.16 67.26,18.29 70.31,18.29 K5.16
  Bottom 0.203: v62.38,23.16 62.18,22.96 49.58,22.96 49.58,21.74 IC1.14
N$22  (via drill 0.3)
  Top 0.305: GPO6.1 65.23,8.33 60.96,12.6 60.96,13.01 K6.S1 60.96,13.21 60.96,13.82 v65.84,18.69
  Bottom 0.305: v65.84,18.69 68.48,18.69 68.48,22.55 70.31,24.38 78.23,24.38 78.23,27.23 77.83,27.64 77.83,29.46 79.05,30.68 90.02,30.68 X1.18
N$23  (via drill 0.41)
  Top 0.203: v18.29,23.77 18.29,22.15 17.88,21.74 v17.88,16.87 | v60.15,11.58 62.18,9.55 62.18,2.64 GND.A5
  Bottom 0.203: v18.29,23.77 16.46,25.6 SJ2.2 | v17.88,16.87 17.88,11.18 52.22,11.18 52.63,10.77 58.93,10.77 59.74,11.58 v60.15,11.58
N$24  (via drill 0.41)
  Top 0.203: v64.62,16.46 64.62,13.41 LED6.C
  Bottom 0.203: v64.62,16.46 62.99,18.09 60.96,18.09 K6.S2
N$25
  Bottom 0.203: IC1.13 50.8,18.29 53.24,18.29 K6.16
N$26  (via drill 0.3)
  Top 0.305: K7.S1 43.89,13.01 43.89,12.6 48.16,8.33 GPO7.1 48.36,8.33 49.99,8.33 v56.08,14.43 | v64.62,33.33 59.74,28.45 v59.74,15.65
  Bottom 0.305: v64.62,33.33 89.81,33.33 90.02,33.53 X1.17 | v59.74,15.65 58.52,14.43 v56.08,14.43
N$28
  Top 0.203: LED7.C 47.35,13.41 43.89,16.87 43.89,18.09 K7.S2
N$29  (via drill 0.41)
  Top 0.203: v49.99,17.68 v52.02,19.71
  Bottom 0.203: v52.02,19.71 52.02,21.54 IC1.12 | v49.99,17.68 49.38,17.07 38.2,17.07 37.19,18.09 36.17,18.09 K7.16
N$30  (via drill 0.3)
  Top 0.305: K8.S1 26.62,13.01 31.29,8.33 GPO8.1 30.28,9.14 v30.28,2.03 | v89,12.39 89,34.14 90.02,35.15 90.02,36.17 X1.16
  Bottom 0.305: v89,12.39 89,6.1 83.52,6.1 78.64,1.22 31.09,1.22 v30.28,2.03
N$31
  Top 0.203: 14.43,11.79 14.43,13.61 JP1.1 | 14.43,11.79 13.41,10.77 U$3.PWR 14.43,11.79 | 14.43,11.79 17.88,8.33 20.93,8.33 GPO8.3
  Bottom 0.203: GPO1.3 31.29,45.11 33.73,47.55 45.72,47.55 48.16,45.11 GPO2.3 48.36,45.11 50.8,47.55 60.96,47.55 63.4,45.11 65.23,45.11 GPO3.3 67.87,47.55 80.06,47.55 82.5,45.11 GPO4.3 82.7,44.91 83.31,44.3 89.41,44.3 92.86,40.84 92.86,18.09 89,18.09 87.78,16.87 85.75,16.87 83.11,14.22 75.39,14.22 74.78,13.61 74.78,8.33 72.54,8.33 GPO5.3 72.34,8.33 69.9,10.77 59.54,10.77 57.1,8.33 55.27,8.33 GPO6.3 55.07,8.33 53.03,10.36 49.17,10.36 48.77,10.77 35.56,10.77 | 35.56,10.77 38,8.33 GPO7.3 | 35.56,10.77 23.57,10.77 21.13,8.33 GPO8.3
N$32
  Top 0.203: LED8.C 30.28,13.41 30.28,14.43 26.62,18.09 K8.S2
N$33  (via drill 0.41)
  Top 0.203: v52.63,15.44 v52.63,17.07 | v23.16,14.02 19.1,18.09 K8.16
  Bottom 0.203: v52.63,17.07 54.46,17.07 54.46,18.49 53.65,19.3 53.44,19.3 53.44,21.54 IC1.11 | v52.63,15.44 51.82,14.63 39.22,14.63 36.58,11.99 29.26,11.99 27.03,14.22 23.37,14.22 v23.16,14.02
N$34
  Bottom 0.203: IC1.2 45.72,31.09 44.91,30.28 44.09,30.28 43.48,30.89 39.22,30.89 38.61,30.28 32.92,30.28 IC2.2
N$35
  Bottom 0.203: IC2.3 32.92,29.67 38.61,29.67 39.42,30.48 43.28,30.48 43.89,29.87 45.72,29.87 46.94,31.09 46.94,31.7 IC1.3
N$36
  Bottom 0.203: IC2.4 32.92,29.06 38.61,29.06 39.62,30.07 42.27,30.07 42.88,29.46 46.53,29.46 48.16,31.09 48.16,31.7 IC1.4
N$37  (via drill 0.41)
  Top 0.203: v37.39,37.39 v37.39,32.92 | v48.97,34.95 v45.72,38.2
  Bottom 0.203: v37.39,32.92 35.76,31.29 35.36,31.29 35.15,31.5 31.7,31.5 31.7,28.65 32.11,28.25 32.72,28.25 IC2.5 | v37.39,37.39 38.2,38.2 v45.72,38.2 | v48.97,34.95 48.97,31.7 IC1.5
N$38  (via drill 0.41)
  Top 0.203: v28.45,31.9 v28.45,30.28 | v26.21,31.9 26.21,34.34 26.62,34.75 v26.62,35.97
  Bottom 0.203: v28.45,30.28 31.09,27.64 32.72,27.64 IC2.6 | v26.21,31.9 v28.45,31.9 | v26.62,35.97 27.23,36.58 51.21,36.58 53.44,34.34 53.44,33.12 51.61,33.12 50.8,32.31 IC1.6
N$39  (via drill 0.41)
  Top 0.203: v52.43,30.07 v52.43,27.43
  Bottom 0.203: v52.43,27.43 51,27.43 49.99,28.45 35.15,28.45 33.73,27.03 32.92,27.03 IC2.7 | v52.43,30.07 52.43,31.7 IC1.7
N$40  (via drill 0.41)
  Top 0.203: v36.78,26.82 39.62,26.82 39.83,27.03 v39.83,29.26 | v58.52,29.87 v58.52,28.25
  Bottom 0.203: v36.78,26.82 34.14,26.82 33.73,26.42 32.92,26.42 IC2.8 | v39.83,29.26 40.23,28.85 50.19,28.85 50.8,28.25 v58.52,28.25 | v58.52,29.87 58.12,30.28 54.25,30.28 53.44,31.09 53.44,31.7 IC1.8
N$41  (via drill 0.41)
  Top 0.203: v50.6,42.47 54.86,38.2 55.27,38.2 RN1.8 | v22.55,40.84 21.74,40.03 LED1.A
  Bottom 0.203: v50.6,42.47 50.19,42.06 23.77,42.06 v22.55,40.84
N$42  (via drill 0.41)
  Top 0.203: v56.29,37.39 55.47,37.39 RN1.7 | v39.83,39.01 39.01,39.83 LED2.A
  Bottom 0.203: v56.29,37.39 54.66,39.01 v39.83,39.01
N$43
  Top 0.203: RN1.6 55.47,36.37 56.49,36.37 57.1,36.98 57.1,38.81 56.08,39.83 LED3.A
N$44
  Top 0.203: RN1.5 55.47,35.56 57.71,35.56 59.33,33.93 60.15,33.93 60.96,34.75 60.96,40.64 58.93,42.67 58.93,46.74 59.74,47.55 66.04,47.55 72.95,40.64 72.95,40.03 LED4.A
N$45  (via drill 0.41)
  Top 0.203: v50.19,9.55 50.19,13.41 49.38,14.22 48.77,14.22 47.75,15.24 RN2.8 | v81.08,12.39 82.3,12.39 83.11,13.21 LED5.A
  Bottom 0.203: v50.19,9.55 54.46,5.28 77.62,5.28 81.08,8.74 v81.08,12.39
N$46  (via drill 0.41)
  Top 0.203: v46.53,15.85 46.74,16.05 47.55,16.05 RN2.7 | v65.63,14.43 65.63,13.82 66.04,13.41 LED6.A
  Bottom 0.203: v46.53,15.85 46.94,16.26 63.8,16.26 v65.63,14.43
N$47
  Top 0.203: RN2.6 47.55,16.87 46.53,16.87 45.72,16.05 45.72,15.65 47.14,14.22 48.16,14.22 48.97,13.41 LED7.A
N$48  (via drill 0.41)
  Top 0.203: v45.52,17.88 47.55,17.88 RN2.5 | v32.31,17.88 32.31,13.82 31.9,13.41 LED8.A
  Bottom 0.203: v45.52,17.88 44.09,19.3 35.15,19.3 33.73,17.88 v32.31,17.88
N$49  (via drill 0.3)
  Top 0.152: OK1.2 26.01,25.4 21.54,20.93 20.93,20.93 v19.51,19.51 | v35.15,17.27 38.2,14.22 v38.2,12.39
  Bottom 0.152: v19.51,19.51 19.51,19.3 21.74,17.07 34.95,17.07 v35.15,17.27 | v38.2,12.39 38.61,11.99 58.93,11.99 59.74,12.8 59.74,14.22 64.82,14.22 67.06,11.99 70.92,11.99 74.78,15.85 84.12,15.85 86.56,18.29 87.58,18.29 X1.10
N$50  (via drill 0.41)
  Top 0.203: v32.92,19.91 32.92,20.73 RN3.1 | v28.65,24.18 30.07,22.76 OK1.1
  Bottom 0.203: v32.92,19.91 29.87,22.96 29.87,24.18 v28.65,24.18
N$51  (via drill 0.41)
  Top 0.203: v24.18,24.59 22.55,22.96 20.73,22.96 OK1.8
  Bottom 0.203: 23.98,25.6 23.57,25.6 RN6.4 | 23.98,25.6 24.59,26.21 25.4,26.21 IC2.21 | v24.18,24.59 24.18,25.6 23.98,25.6
N$52  (via drill 0.41)
  Top 0.203: v33.73,19.3 33.73,20.73 RN3.2 | v28.65,26.62 30.07,28.04 OK1.3
  Bottom 0.203: v33.73,19.3 33.73,21.74 32.11,21.74 30.28,23.57 30.28,26.62 v28.65,26.62
N$53  (via drill 0.41)
  Top 0.203: v34.75,19.91 34.75,20.73 RN3.3 | v44.91,19.91 47.75,22.76 OK2.1
  Bottom 0.203: v44.91,19.91 v34.75,19.91
N$54  (via drill 0.41)
  Top 0.203: v36.78,22.15 35.56,20.93 RN3.4 | v41.45,22.55 41.45,23.37 45.92,27.84 47.75,27.84 OK2.3
  Bottom 0.203: v36.78,22.15 37.19,22.55 v41.45,22.55
N$55  (via drill 0.3)
  Top 0.152: v69.7,25.4 OK3.2 | v80.67,28.65 v77.42,25.4
  Bottom 0.152: v77.42,25.4 v69.7,25.4 | v80.67,28.65 81.28,29.26 87.58,29.26 X1.6
N$56
  Top 0.203: RN4.1 68.48,20.93 67.67,20.93 65.84,22.76 OK3.1
N$57
  Top 0.203: RN4.2 69.29,20.73 69.29,20.52 68.89,20.12 66.04,20.12 64.41,21.74 64.41,26.62 65.63,27.84 OK3.3
N$58  (via drill 0.41)
  Top 0.203: v70.31,19.91 70.31,20.73 RN4.3 | v80.67,20.12 83.31,22.76 OK4.1
  Bottom 0.203: v70.31,19.91 70.51,20.12 v80.67,20.12
N$59  (via drill 0.41)
  Top 0.203: v75.18,20.93 71.12,20.93 RN4.4 | v77.01,21.54 83.31,27.84 OK4.3
  Bottom 0.203: v75.18,20.93 75.79,21.54 v77.01,21.54
N$60  (via drill 0.3)
  Top 0.152: v38.2,48.16 32.11,42.06 32.11,32.31 30.28,30.48 OK1.4 | v88.59,44.91 92.05,41.45 v92.05,21.74
  Bottom 0.152: v38.2,48.16 38.41,47.95 85.55,47.95 v88.59,44.91 | v92.05,21.74 91.64,21.34 87.78,21.34 X1.9
N$61  (via drill 0.3)
  Top 0.152: v56.9,5.89 56.69,5.69 47.75,5.69 46.74,6.71 46.74,8.74 42.67,12.8 42.67,19.91 47.75,24.99 47.75,25.4 OK2.2 | v76,11.79 77.01,12.8 77.01,18.69 v81.89,23.57
  Bottom 0.152: v56.9,5.89 57.1,5.69 72.95,5.69 76,8.74 v76,11.79 | v81.89,23.57 82.09,23.77 87.58,23.77 X1.8
N$62  (via drill 0.3)
  Top 0.152: OK2.4 49.17,30.48 v49.58,30.07 | v64.21,30.07 v63.2,29.06 | v77.42,30.07 80.47,30.07 v81.89,28.65
  Bottom 0.152: v49.58,30.07 50.6,29.06 v63.2,29.06 | v77.42,30.07 v64.21,30.07 | v81.89,28.65 83.72,26.82 87.58,26.82 X1.7
N$63  (via drill 0.41)
  Top 0.203: v75.59,28.04 74.17,28.04 OK4.6 | v34.14,37.59 v35.97,39.42
  Bottom 0.203: IC2.28 25.4,31.09 24.99,31.5 23.57,31.5 RN5.1 23.57,31.7 23.57,34.75 25.81,36.98 33.53,36.98 v34.14,37.59 | v75.59,28.04 74.57,29.06 64.21,29.06 57.1,36.17 57.1,41.25 37.8,41.25 v35.97,39.42
N$64  (via drill 0.3)
  Top 0.152: v67.46,32.11 65.84,30.48 OK3.4
  Bottom 0.152: v67.46,32.11 87.58,32.11 X1.5
N$65
  Top 0.152: OK4.2 86.56,28.45 86.56,33.93 87.58,34.95 X1.4
N$66
  Top 0.152: OK4.4 83.52,32.51 87.58,36.58 87.58,37.59 X1.3
N$68  (via drill 0.41)
  Top 0.203: v27.03,26.62 21.95,26.62 20.73,27.84 OK1.6
  Bottom 0.203: RN6.3 23.57,26.42 24.18,26.42 24.79,27.03 25.4,27.03 IC2.22 25.6,27.03 26.62,27.03 v27.03,26.62
N$69  (via drill 0.41)
  Top 0.203: v27.43,27.64 29.06,29.26 31.29,29.26 33.73,31.7 v33.73,32.92 | v45.92,33.33 45.92,29.06 v41.45,24.59 | v39.83,24.18 38.61,22.96 OK2.8
  Bottom 0.203: RN6.2 23.57,27.23 24.38,27.23 24.79,27.64 25.4,27.64 IC2.23 25.6,27.64 v27.43,27.64 | v33.73,32.92 34.54,33.73 41.86,33.73 42.27,33.33 v45.92,33.33 | v41.45,24.59 41.05,24.18 v39.83,24.18
N$70  (via drill 0.41)
  Top 0.203: v28.04,29.26 28.04,29.67 27.64,30.07 27.64,32.11 28.25,32.72 29.87,32.72 v30.68,31.9 | v35.56,32.11 35.56,30.89 38.41,28.04 OK2.6
  Bottom 0.203: RN6.1 23.57,28.04 23.77,28.25 25.4,28.25 IC2.24 25.6,28.25 27.03,28.25 v28.04,29.26 | v30.68,31.9 30.89,32.11 v35.56,32.11
N$71  (via drill 0.41)
  Top 0.203: v20.52,19.3 28.04,19.3 v31.5,15.85 | v51,17.48 56.29,22.76 OK3.8
  Bottom 0.203: IC2.25 25.4,29.06 23.77,29.06 23.57,29.26 RN5.4 23.37,29.26 22.55,28.45 21.74,28.45 20.52,27.23 v20.52,19.3 | v31.5,15.85 31.9,16.26 45.92,16.26 46.33,16.66 50.19,16.66 v51,17.48
N$72  (via drill 0.41)
  Top 0.203: v27.03,32.72 v27.03,29.46 | v52.63,34.14 52.63,31.5 56.08,28.04 OK3.6
  Bottom 0.203: RN5.3 23.57,30.07 23.77,29.87 24.38,29.87 24.59,29.67 25.4,29.67 IC2.26 25.6,29.46 v27.03,29.46 | v27.03,32.72 28.25,33.93 30.48,33.93 32.72,36.17 50.6,36.17 v52.63,34.14
N$73  (via drill 0.41)
  Top 0.203: v30.68,32.92 29.67,33.93 29.46,33.93 28.85,34.54 v28.85,41.05 | v74.57,34.75 74.57,33.33 71.93,30.68 71.93,24.99 73.97,22.96 OK4.8
  Bottom 0.203: RN5.2 23.57,30.68 24.38,30.68 24.79,30.28 25.4,30.28 IC2.27 25.6,30.28 27.43,30.28 28.25,31.09 28.85,31.09 v30.68,32.92 | v28.85,41.05 29.46,41.66 64.41,41.66 71.32,34.75 v74.57,34.75
RES
  Top 0.203: S1.B2 16.26,18.69 16.26,17.48 24.59,9.14 24.59,6.71 29.87,1.42 30.68,1.42 31.7,2.44 GND.RESET
VIN  (via drill 0.41)
  Top 0.203: v15.85,4.06 10.97,8.94 10.97,13.01 14.43,16.46 JP1.2
  Bottom 0.203: v15.85,4.06 42.88,4.06 44.3,2.64 GND.VIN

### Text on the board
_tsilk: SCL SDA | SKAARHOJ 2012 | Fusion: 63103 | JP1: VIN => TallyPwr | TallyPwr | TallyPwr | GND | O | 2x8GPIO v05-11-12 | GND
_bsilk: I2C PullUps | I2C to A4/A5 | 1